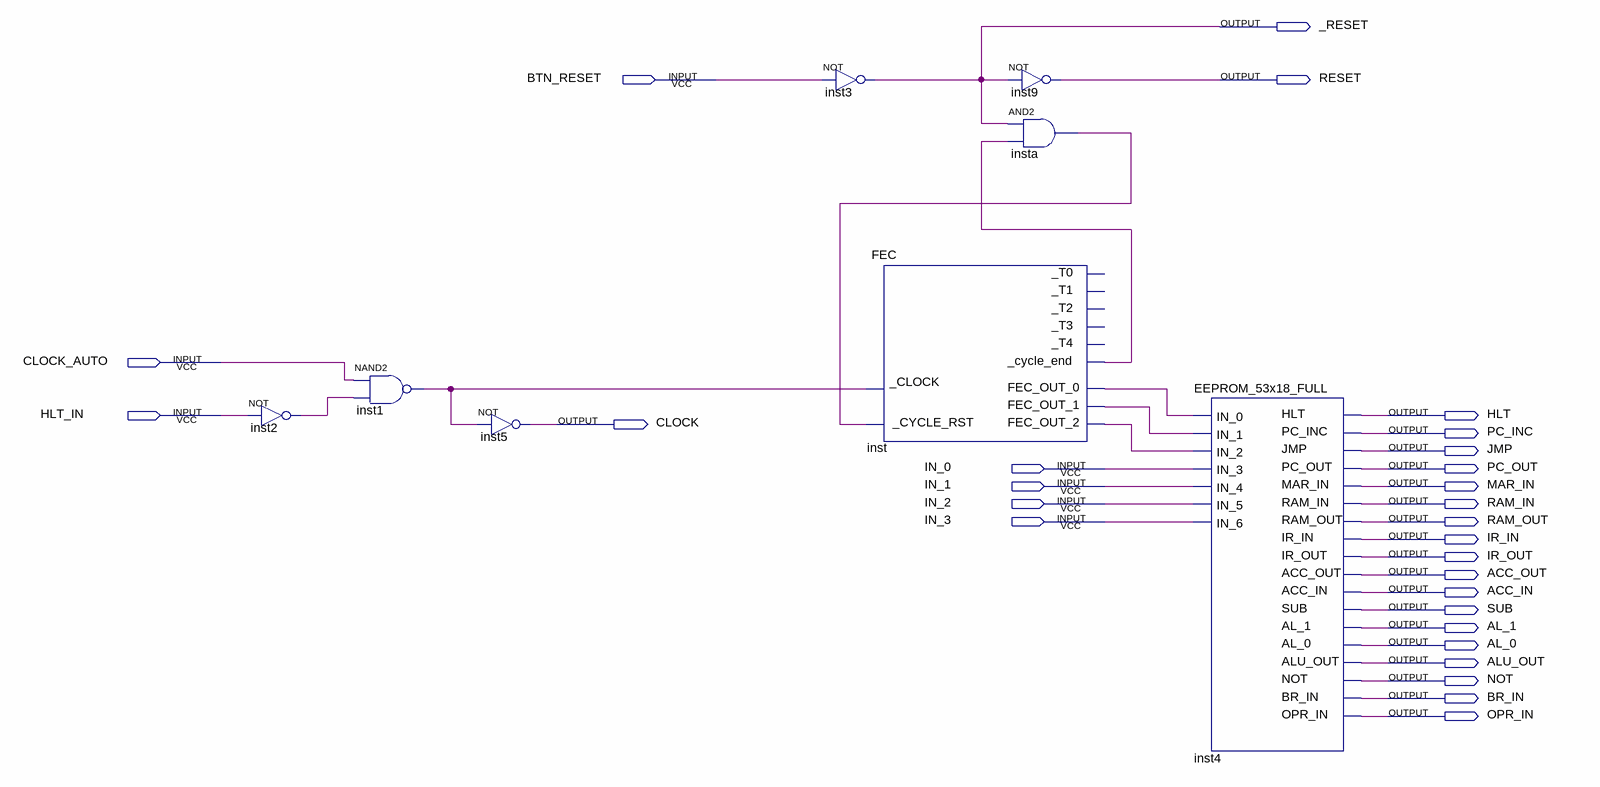
[diagram p0: schematic sheet]
// Quartus schematic CTRL.bdf as structural Verilog: 8 symbols, 28 pins
module CTRL (
  input  BTN_RESET,
  input  CLOCK_AUTO,
  input  HLT_IN,
  input  IN_0,
  input  IN_1,
  input  IN_2,
  input  IN_3,
  output _RESET,
  output RESET,
  output HLT,
  output CLOCK,
  output PC_INC,
  output JMP,
  output PC_OUT,
  output MAR_IN,
  output RAM_IN,
  output RAM_OUT,
  output IR_IN,
  output IR_OUT,
  output ACC_OUT,
  output ACC_IN,
  output SUB,
  output AL_1,
  output AL_0,
  output ALU_OUT,
  output NOT,
  output BR_IN,
  output OPR_IN
);

  wire inst1_out, inst2_out, inst__cycle_end, inst_fec_out_0, inst_fec_out_1, inst_fec_out_2, insta_out;

  not inst2 (inst2_out, HLT_IN);
  nand inst1 (inst1_out, CLOCK_AUTO, inst2_out);
  not inst5 (CLOCK, inst1_out);
  not inst3 (_RESET, BTN_RESET);
  FEC inst (
    ._CLOCK(inst1_out), ._CYCLE_RST(insta_out), ._cycle_end(inst__cycle_end), .FEC_OUT_0(inst_fec_out_0),
    .FEC_OUT_1(inst_fec_out_1), .FEC_OUT_2(inst_fec_out_2));  // open: _T0, _T1, _T2, _T3, _T4
  not inst9 (RESET, _RESET);
  and insta (insta_out, _RESET, inst__cycle_end);
  EEPROM_53x18_FULL inst4 (
    .IN_0(inst_fec_out_0), .IN_1(inst_fec_out_1), .IN_2(inst_fec_out_2), .IN_3(IN_0), .IN_4(IN_1),
    .IN_5(IN_2), .IN_6(IN_3), .HLT(HLT), .PC_INC(PC_INC), .JMP(JMP), .PC_OUT(PC_OUT), .MAR_IN(MAR_IN),
    .RAM_IN(RAM_IN), .RAM_OUT(RAM_OUT), .IR_IN(IR_IN), .IR_OUT(IR_OUT), .ACC_OUT(ACC_OUT), .SUB(SUB),
    .AL_1(AL_1), .AL_0(AL_0), .ALU_OUT(ALU_OUT), .NOT(NOT), .BR_IN(BR_IN), .OPR_IN(OPR_IN), .ACC_IN(ACC_IN));
endmodule
